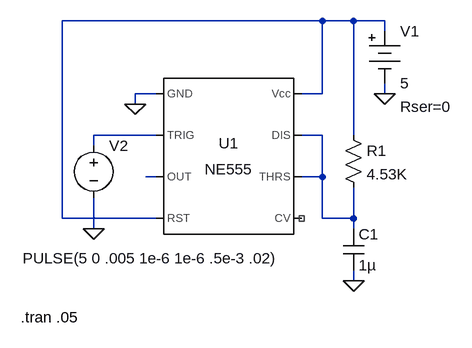
[diagram p0: schematic OneShot.asc]
OneShot.asc, the LTspice schematic file:
Version 4
SHEET 1 880 680
WIRE 304 48 -96 48
WIRE 352 48 304 48
WIRE 400 48 352 48
WIRE 400 64 400 48
WIRE 48 160 16 160
WIRE 304 160 304 48
WIRE 304 160 272 160
WIRE 400 160 400 144
WIRE 16 176 16 160
WIRE 48 224 -48 224
WIRE 304 224 272 224
WIRE 352 224 352 48
WIRE -48 240 -48 224
WIRE 48 288 32 288
WIRE 304 288 304 224
WIRE 304 288 272 288
WIRE -96 352 -96 48
WIRE 48 352 -96 352
WIRE 304 352 304 288
WIRE 352 352 352 304
WIRE 352 352 304 352
WIRE -48 368 -48 320
WIRE 352 368 352 352
WIRE 352 448 352 432
FLAG 16 176 0
FLAG 400 160 0
FLAG -48 368 0
FLAG 352 448 0
SYMBOL Misc\\NE555 160 256 R0
SYMATTR InstName U1
SYMBOL Misc\\battery 400 48 R0
WINDOW 123 0 0 Left 0
WINDOW 39 24 132 Left 0
SYMATTR SpiceLine Rser=0
SYMATTR InstName V1
SYMATTR Value 5
SYMBOL voltage -48 224 R0
WINDOW 3 -109 189 Left 0
WINDOW 123 0 0 Left 0
WINDOW 39 0 0 Left 0
SYMATTR Value PULSE(5 0 .005 1e-6 1e-6 .5e-3 .02)
SYMATTR InstName V2
SYMBOL res 336 208 R0
SYMATTR InstName R1
SYMATTR Value 4.53K
SYMATTR SpiceLine tol=1 pwr=0.1
SYMBOL cap 336 368 R0
SYMATTR InstName C1
SYMATTR Value 1µ
TEXT -160 504 Left 0 !.tran .05

The netlist it stands for:
* OneShot.asc
XU1 0 N002 N004 N001 NC_01 N003 N003 N001 NE555  ; pins GND TRIG OUT RST CV THRS DIS Vcc
V1 N001 0 5 Rser=0
V2 N002 0 PULSE(5 0 .005 1e-6 1e-6 .5e-3 .02)
R1 N001 N003 4.53K tol=1 pwr=0.1
C1 N003 0 1µ
.tran .05
.lib NE555.sub
.backanno
.end